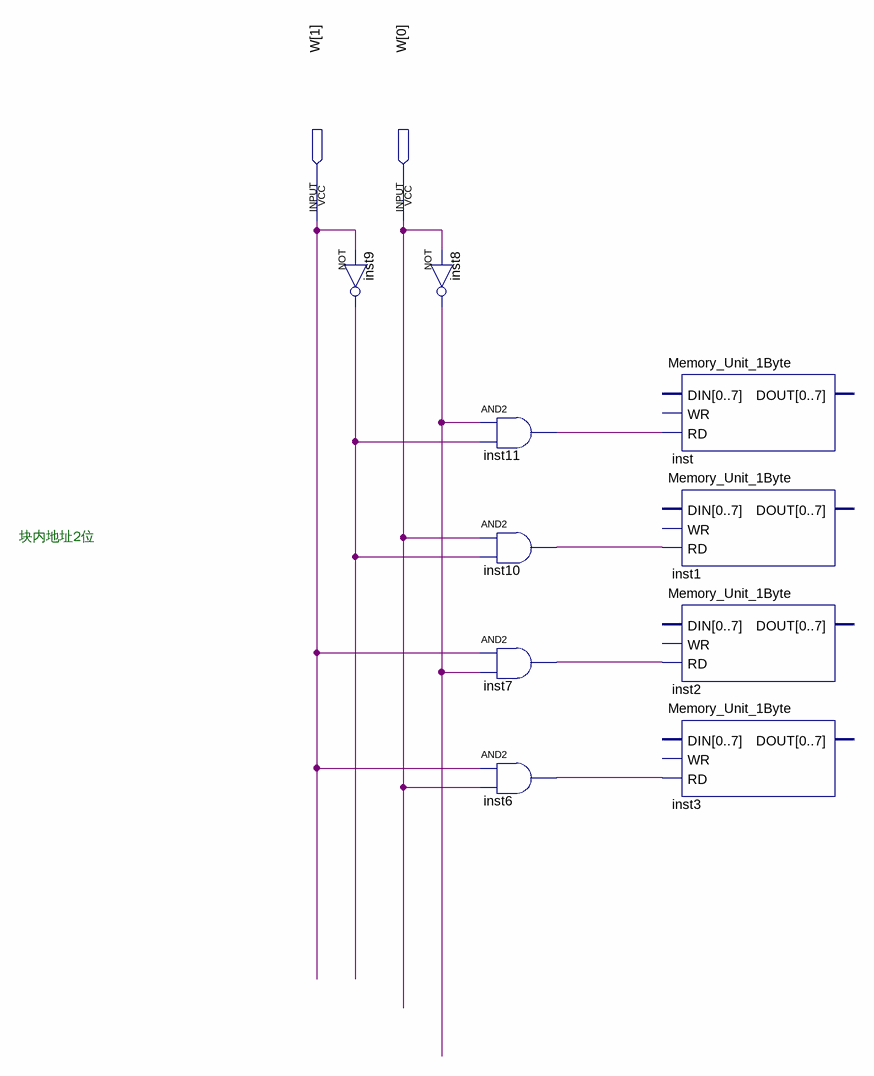
[diagram p0: schematic sheet]
// Quartus schematic Memory_Unit_1Block(4Bytes).bdf as structural Verilog: 10 symbols, 2 pins
module \Memory_Unit_1Block(4Bytes)  (
  input  [1:0] W
);

  wire inst6_out, inst7_out, inst8_out, inst9_out, inst10_out, inst11_out;

  not inst9 (inst9_out, W[1]);
  not inst8 (inst8_out, W[0]);
  and inst11 (inst11_out, inst8_out, inst9_out);
  and inst10 (inst10_out, W[0], inst9_out);
  and inst7 (inst7_out, W[1], inst8_out);
  and inst6 (inst6_out, W[1], W[0]);
  Memory_Unit_1Byte inst (.RD(inst11_out));  // open: DIN, WR, DOUT
  Memory_Unit_1Byte inst1 (.RD(inst10_out));  // open: DIN, WR, DOUT
  Memory_Unit_1Byte inst2 (.RD(inst7_out));  // open: DIN, WR, DOUT
  Memory_Unit_1Byte inst3 (.RD(inst6_out));  // open: DIN, WR, DOUT

  // Notes on the sheet:
  //   块内地址2位
endmodule
